# Altium schematic sheet LED.SchDoc
size A4; SheetNumber: 10; SheetTotal: 13
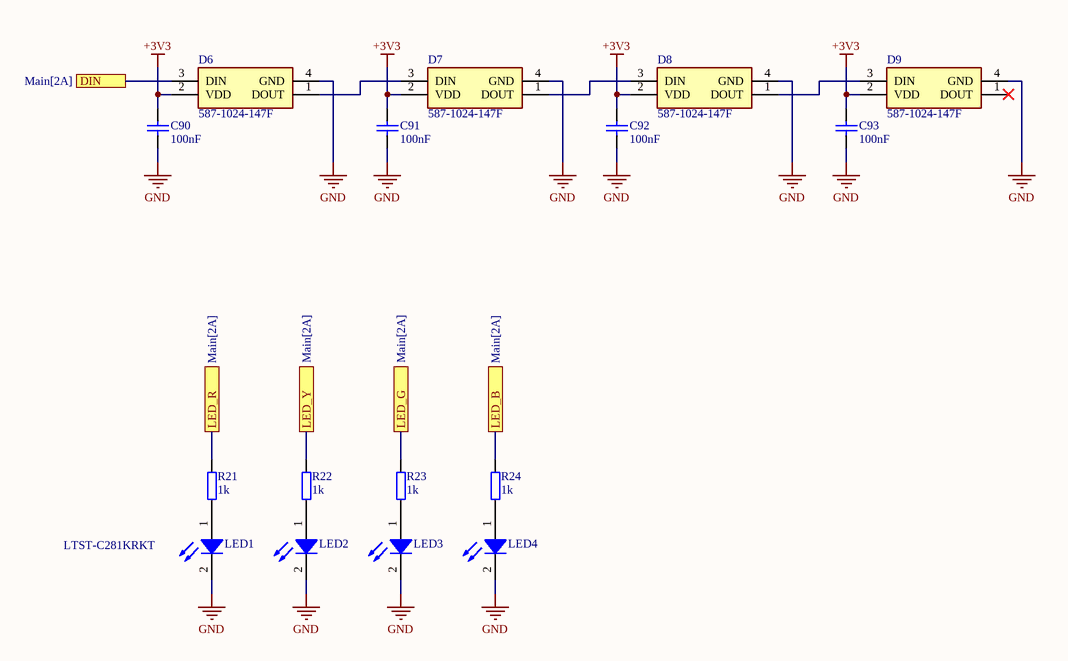
[diagram p0: LED.SchDoc]

## Parts
C90  value 100nF  [CAP0402]  (hidden comment: Cap0402)
C91  value 100nF  [CAP0402]  (hidden comment: Cap0402)
C92  value 100nF  [CAP0402]  (hidden comment: Cap0402)
C93  value 100nF  [CAP0402]  (hidden comment: Cap0402)
D6  587-1024-147F  [5871024147F]
D7  587-1024-147F  [5871024147F]
D8  587-1024-147F  [5871024147F]
D9  587-1024-147F  [5871024147F]
LED1  LTST-C281KRKT  [LTSTC281KRKT]
LED2  LTST-C281KSKT  [LTSTC281KRKT]  (value not drawn)
LED3  LTST-C281KGKT  [LTSTC281KRKT]  (value not drawn)
LED4  LTST-C281KBKT  [LTSTC281KRKT]  (value not drawn)
R21  value 1k  [RES0402]  (hidden comment: Res0402)
R22  value 1k  [RES0402]  (hidden comment: Res0402)
R23  value 1k  [RES0402]  (hidden comment: Res0402)
R24  value 1k  [RES0402]  (hidden comment: Res0402)

## Ports
DIN (see Main[2A]), LED_B (see Main[2A]), LED_G (see Main[2A]), LED_R (see Main[2A]), LED_Y (see Main[2A])

## Nets
+3V3: C90.2 C91.2 C92.2 C93.2 D6.2(VDD) D7.2(VDD) D8.2(VDD) D9.2(VDD)
GND: C90.1 C91.1 C92.1 C93.1 D6.4(GND) D7.4(GND) D8.4(GND) D9.4(GND) LED1.2(A) LED2.2(A) LED3.2(A) LED4.2(A)
DIN: D6.3(DIN) ; port DIN
LED_B: R24.1 ; port LED_B
LED_G: R23.1 ; port LED_G
LED_R: R21.1 ; port LED_R
LED_Y: R22.1 ; port LED_Y
NetD6_1: D6.1(DOUT) D7.3(DIN)
NetD7_1: D7.1(DOUT) D8.3(DIN)
NetD8_1: D8.1(DOUT) D9.3(DIN)
NetLED1_1: LED1.1(K) R21.2
NetLED2_1: LED2.1(K) R22.2
NetLED3_1: LED3.1(K) R23.2
NetLED4_1: LED4.1(K) R24.2

Not connected (* = marked no-connect by the designer): D9 1(DOUT)*

## Library data of the parts
C90-C93 = Cap0402: Manufacturer_Part_Number: GRM155R71H104ME14D; Voltage: 50V
D6-D9 = 587-1024-147F: LED; Manufacturer_Name: Dialight; Datasheet Link: https://s3-us-west-2.amazonaws.com/catsy.557/Dialight_datasheet_587-1024-147F_Addressable_RGB.pdf; Height: 0.9mm; Manufacturer_Part_Number: 587-1024-147F
LED1-LED4 = LTST-C281KRKT: LED (Multiple); Manufacturer_Name: Lite-On; Datasheet Link: https://www.digikey.ph/en/products/detail/liteon/LTST-C281KRKT/3198723; Height: 0.35mm; Manufacturer_Part_Number: LTST-C281KRKT; Mouser Part Number: 859-LTST-C281KRKT; Mouser Price/Stock: https://www.mouser.co.uk/ProductDetail/Lite-On/LTST-C281KRKT?qs=xb8aMrBSZRKAPWJcmf%2F7XQ%3D%3D; Arrow Part Number: LTST-C281KRKT; Arrow Price/Stock: https://www.arrow.com/en/products/ltst-c281krkt/lite-on-technology?region=nac
R21-R24 = Res0402: Manufacturer_Part_Number: RC0402DR-071KL